# EAGLE design RescueMe (EAGLE 7.6.0)
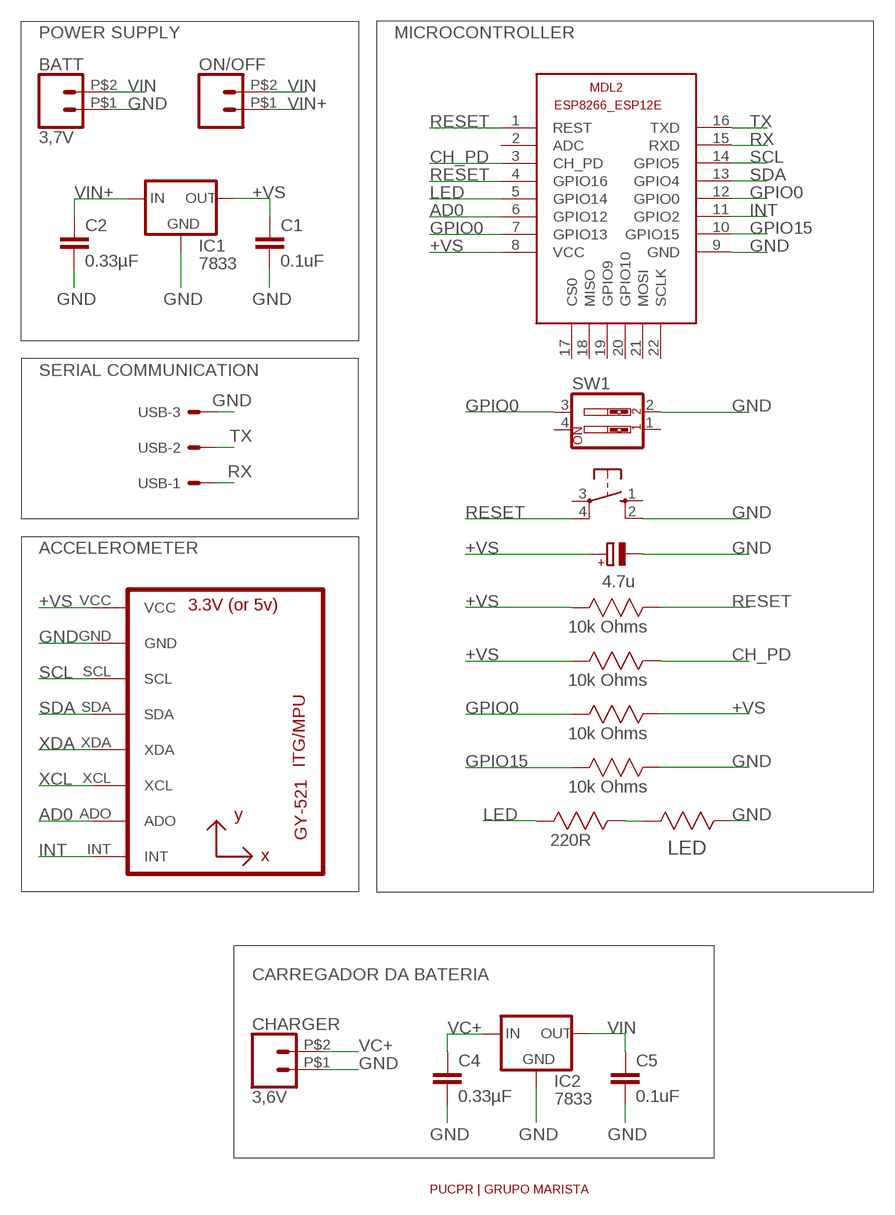
[diagram p0: schematic, sheet 1]

## Parts
BATT  3,7V  CONN_02PTH2  [1X02_BIG]
C1  0.1uF  0.33UF/330NF-0805-50V-10%  [0805]
C2  0.33µF  0.33UF/330NF-0805-50V-10%  [0805]
C4  0.33µF  0.33UF/330NF-0805-50V-10%  [0805]
C5  0.1uF  0.33UF/330NF-0805-50V-10%  [0805]
C7  4.7u  CPOL-EU153CLV-0405  [153CLV-0405]
CHARGER  3,6V  CONN_02PTH2  [1X02_BIG]
IC1  7833  78XXS  [78XXS]
IC2  7833  78XXS  [78XXS]
LED  ERA-6AEB221V  [RESC2013X65N]
MDL2  ESP8266  ESP8266-12EESP8266-ESP12E  [ESP8266-ESP12E]
ON/OFF  CONN_02PTH2  [1X02_BIG]
R_CHPD  10k Ohms  ERA6AEB103V  [RESC2013X65N]
R_G0  10k Ohms  ERA6AEB103V  [RESC2013X65N]
R_G15  10k Ohms  ERA6AEB103V  [RESC2013X65N]
R_LED  220R  ERA-6AEB221V  [RESC2013X65N]
R_RST  10k Ohms  ERA6AEB103V  [RESC2013X65N]
S1  10-XX  [B3F-10XX]
SW1  SW_DIP-2  [DIPSWITCH-02]
U1  GY-521MPU6050  [GY-521]
U$1  PUCPR_G  [PUCPR]
USB  22-27-2031-03  [6410-03]

## Nets
+VS: C1.1 C7.+ IC1.OUT MDL2.8(VCC) R_CHPD.2(R2) R_G0.1(R1) R_RST.2(R2) U1.VCC
AD0: MDL2.6(GPIO12) U1.ADO
CH_PD: MDL2.3(CH_PD) R_CHPD.1(R1)
GND: BATT.P$1 C1.2 C2.2 C4.2 C5.2 C7.- CHARGER.P$1 IC1.GND IC2.GND LED.1(R1) MDL2.9(GND) R_G15.1(R1) S1.2(S1) SW1.2 U1.GND USB.3
GPIO0: MDL2.7(GPIO13) MDL2.12(GPIO0) R_G0.2(R2) SW1.3
GPIO15: MDL2.10(GPIO15) R_G15.2(R2)
INT: MDL2.11(GPIO2) U1.INT
LED: MDL2.5(GPIO14) R_LED.2(R2)
N$1: LED.2(R2) R_LED.1(R1)
RESET: MDL2.1(REST) MDL2.4(GPIO16) R_RST.1(R1) S1.4(P1)
RX: MDL2.15(RXD) USB.1
SCL: MDL2.14(GPIO5) U1.SCL
SDA: MDL2.13(GPIO4) U1.SDA
TX: MDL2.16(TXD) USB.2
VC+: C4.1 CHARGER.P$2 IC2.IN
VIN: BATT.P$2 C5.1 IC2.OUT ON/OFF.P$2
VIN+: C2.1 IC1.IN ON/OFF.P$1
XCL: U1.XCL
XDA: U1.XDA
Unconnected: MDL2.2(ADC) MDL2.17(CS0) MDL2.18(MISO) MDL2.19(GPIO9) MDL2.20(GPIO10) MDL2.21(MOSI) MDL2.22(SCLK) S1.1(S) S1.3(P) SW1.1 SW1.4

## Notes on the sheet
- POWER SUPPLY | MICROCONTROLLER
- SERIAL COMMUNICATION
- ACCELEROMETER
- CARREGADOR DA BATERIA

## Library data of the parts
BATT CHARGER ON/OFF = SparkFun-Connectors:CONN_02: Multi connection point. Often used as Generic Header-pin footprint for 0.1 inch spaced/style header connections On any of the 0.1 inch spaced packages, you can populate with these: Break Away Headers - Straight <https://www.sparkfun.com/products/116> (PRT-00116) Break Away Male Headers - Right Angle <https://www.sparkfun.com/products/553> (PRT-00553) Female Headers <https://www.sparkfun.com/products/115> (PRT-00115) Break Away Headers - Machine Pin <https://www.sparkfun.com/products/117> (PRT-00117) Break Away Female Headers - Swiss Machine Pin <https://www.sparkfun.com/products/743> (PRT-00743) For SCREWTERMINALS and SPRING TERMINALS visit here: Screw Terimnals on SparkFun.com <https://www.sparkfun.com/search/results?term=Screw+Terminals> (5mm/3.5mm/2.54mm spacing) This device is also useful as a general connection point to wire up your design to another part of your project. Our various solder wires solder well into these plated through hole pads. Hook-Up Wire - Assortment (Stranded, 22 AWG) <https://www.sparkfun.com/products/11375> (PRT-11375) Hook-Up Wire - Assortment (Solid Core, 22 AWG) <https://www.sparkfun.com/products/11367> (PRT-11367) View the entire wire category on our website here <https://www.sparkfun.com/categories/141> Special notes: Molex polarized connector foot print use with: PRT-08233 with associated crimp pins and housings. 2.54_SCREWTERM for use with PRT-10571. 3.5mm Screw Terminal footprints for PRT-08084 5mm Screw Terminal footprints for use with PRT-08432
C1 C5 = Capacitores:0.33UF/330NF: 0.33µF/330nF ceramic capacitors A capacitor is a passive two-terminal electrical component used to store electrical energy temporarily in an electric field.; PROD_ID: CAP-08469; VALUE: 0.33µF
C2 C4 = Capacitores:0.33UF/330NF: 0.33µF/330nF ceramic capacitors A capacitor is a passive two-terminal electrical component used to store electrical energy temporarily in an electric field.; PROD_ID: CAP-08469
C7 = rcl:CPOL-EU: POLARIZED CAPACITOR, European symbol
IC1 IC2 = v-reg-3:78XXS: VOLTAGE REGULATOR
LED R_LED = Panasonic:ERA-6AEB221V: RESISTOR, 0805; MPN: ERA-6AEB221V; OC_FARNELL: 1811421; OC_NEWARK: 08N2157; SUPPLIER: Panasonic; TOLERANCE: ±0.1 %; VALUE: 220 Ohm; WATTAGE: 0.125 W
MDL2 = Espressif:ESP8266-12E: ESP8266-12E with additional I/O and GPIO04/05 corrected The author cannot warrant that this library is free from error or will meet your specific requirements. Created by PuceBaboon.com. Komagane, Nagano, JAPAN; MPN: 317060015
R_CHPD R_G0 R_G15 R_RST = Panasonic:ERA6AEB103V: RESISTOR, 0805; MPN: ERA6AEB103V; OC_FARNELL: 1577673; OC_NEWARK: 08N2142; SUPPLIER: Panasonic; TOLERANCE: ±0.1 %; WATTAGE: 0.125 W
S1 = switch-omron:10-XX: OMRON SWITCH; MPN: B3F-1000; OC_FARNELL: 176432; OC_NEWARK: 36M3542
SW1 = SparkFun:SW_DIP-2: DIP SWITCH
U1 = gy-521:GY-521
U$1 = Simbolos:PUCPR_G
USB = Molex:22-?-03: CONNECTOR wire to board 2.54 mm (.1 inch) pitch header; OC_FARNELL: unknown; OC_NEWARK: unknown

## Board
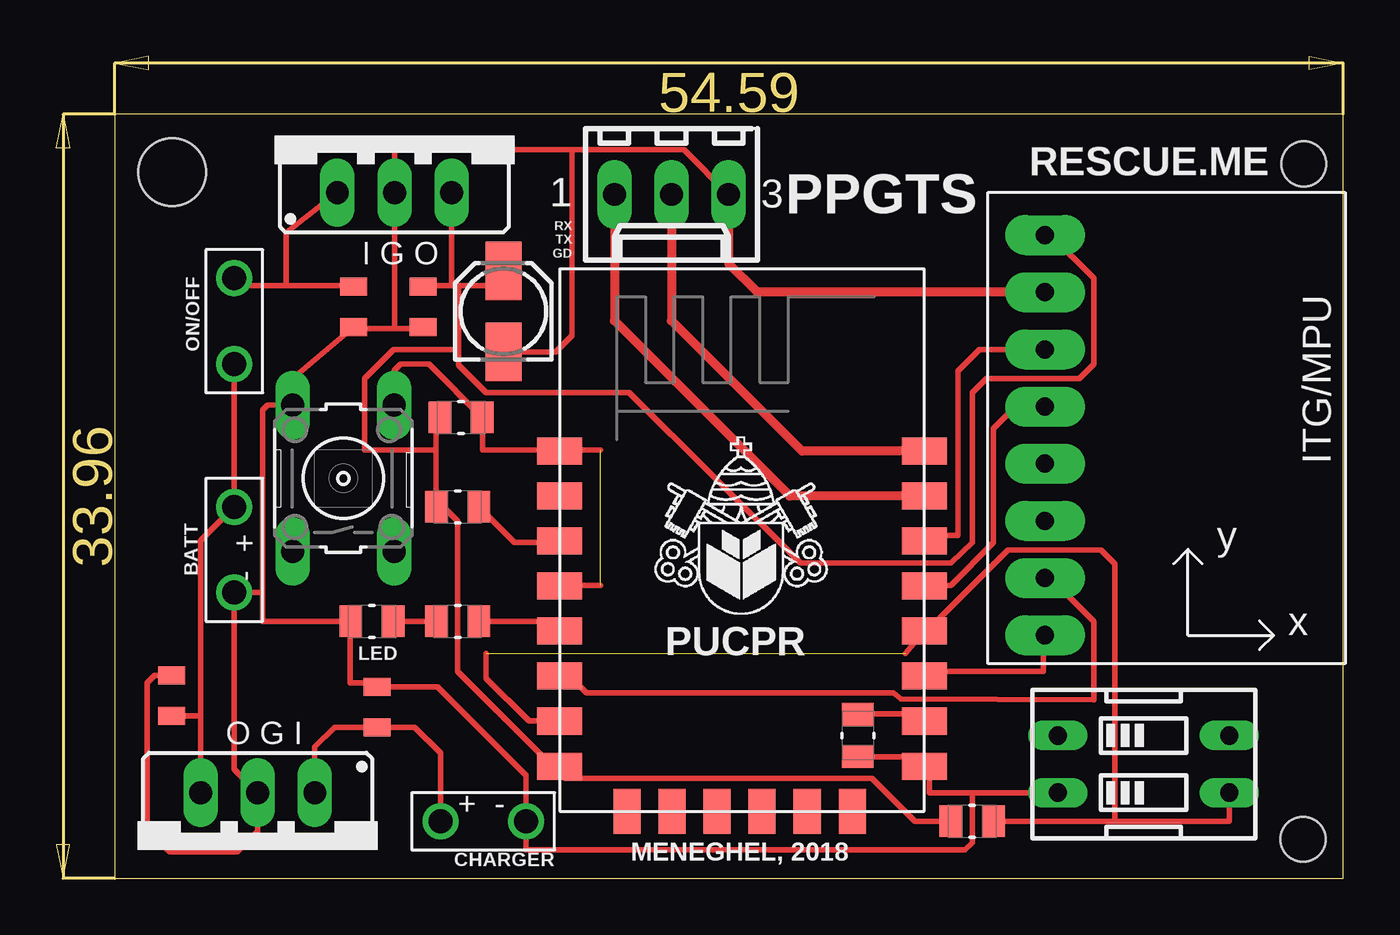
[diagram p1: board, top side]

Size 54.59 x 33.96 mm. Coordinates in mm from the lower left corner, seen from the top.
Outline: 0,0 54.59,0 54.59,33.96 0,33.96 0,0
Copper layers (1*16): Top 0.035mm / dielectric 1.5mm / Bottom 0.035mm
Design rules "default": minimum track width 10mil, minimum drill 24mil, track to track 8mil, track to pad 8mil, pad to pad 8mil, via to via 8mil, smd to smd 8mil, copper to edge 40mil, drill to drill 8mil, minimum pad ring 10mil, minimum via ring 8mil, stop-mask expansion 4mil, vias tented up to drill 0mil, thermal gap 10mil
Holes 2 mm at 52.84,31.75 52.8,1.74
Holes 3 mm at 2.55,31.39

### Footprints (pad centres in the part's own frame; a part is rotated, then mirrored left to right if it is on the bottom)
1X02_BIG = drill 1.067: P$1 0,0; P$2 3.81,0
0805 = smd 0.8 x 1.2: 1 -0.9,0; 2 0.9,0
153CLV-0405 = smd 2.6 x 1.6: + 1.8,0; - -1.8,0
78XXS = drill 1.016 long: GND 0,-2.54; IN -2.54,-2.54; OUT 2.54,-2.54
RESC2013X65N = smd 1.016 x 1.397: 1 -0.94,0; 2 0.94,0
ESP8266-ESP12E = smd 2 x 1.2: 1 -7.62,5.84; 2 -7.62,3.84; 3 -7.62,1.84; 4 -7.62,-0.16; 5 -7.62,-2.16; 6 -7.62,-4.16; 7 -7.62,-6.16; 8 -7.62,-8.16; 9 8.58,-8.16; 10 8.58,-6.16; 11 8.58,-4.16; 12 8.58,-2.16; 13 8.58,-0.16; 14 8.58,1.84; 15 8.58,3.84; 16 8.58,5.84 | smd 1.2 x 2: 17 -4.62,-10.16; 18 -2.62,-10.16; 19 -0.62,-10.16; 20 1.38,-10.16; 21 3.38,-10.16; 22 5.38,-10.16
B3F-10XX = drill 1.016 long: 1 -3.251,2.261; 2 3.251,2.261; 3 -3.251,-2.261; 4 3.251,-2.261
DIPSWITCH-02 = drill 0.813 long: 1 -1.27,-3.81; 2 1.27,-3.81; 3 1.27,3.81; 4 -1.27,3.81
GY-521 = drill 0.8 pad 1.778 long: ADO -8.89,-6.35; GND -8.89,6.35; INT -8.89,-8.89; SCL -8.89,3.81; SDA -8.89,1.27; VCC -8.89,8.89; XCL -8.89,-3.81; XDA -8.89,-1.27
6410-03 = drill 1.016 long: 1 2.54,0; 2 0,0; 3 -2.54,0

### Placement (x,y rotation side)
BATT  5.31,12.7 90 top
C1  13.7,25.4 270 top
C2  10.62,25.4 270 top
C4  11.66,7.62 90 top
C5  2.54,8.12 90 top
C7  17.27,25.2 90 top
CHARGER  18.28,2.54 180 top
IC1  12.43,33.02 0 top
IC2  6.35,1.27 180 top
LED  11.43,11.43 0 top
MDL2  27.39,13.15 0 top
ON/OFF  5.31,26.67 270 top
R_CHPD  15.24,16.51 180 top
R_G0  38.1,2.54 0 top
R_G15  33.02,6.35 90 top
R_LED  15.24,11.43 0 top
R_RST  15.39,20.49 180 top
S1  10.16,17.78 90 top
SW1  45.72,5.08 270 top
U1  50.23,19.7 0 top
U$1  27.69,14.25 0 top
USB  24.74,30.4 180 top

### Tracks (layer width: path | path; a pad name or v marks a point on that pad's centre or on a via)
+VS
  Top 0.254: 14.29,19.05 14.29,20.44 R_RST.2 | 14.29,19.05 14.29,16.51 R_CHPD.2 14.61,16.51 15.24,15.87 15.24,9.21 19.68,4.76 MDL2.8 20,4.76 20,4.45 33.66,4.45 35.56,2.54 R_G0.1 | 15.29,26.35 14.97,26.35 | IC1.OUT 14.97,26.35 | 15.29,26.35 15.29,23.5 | U1.VCC 41.59,28.57 43.5,26.67 43.5,22.86 42.86,22.23 38.73,22.23 38.1,21.59 38.1,14.92 37.15,14.02 30.48,14.02 22.86,21.59 16.51,21.59 15.29,22.81 15.29,23.5 | 14.29,19.05 11.11,19.05 11.11,22.23 12.38,23.5 15.29,23.5 | 14.97,26.35 13.75,26.35 C1.1 | 15.29,26.35 16.62,26.35 C7.+
AD0
  Top 0.254: MDL2.6 20,8.89 20.32,8.89 20.96,8.25 34.61,8.25 34.92,7.99 43.5,7.94 43.5,11.43 41.59,13.33 U1.ADO
CH_PD
  Top 0.254: MDL2.3 19.68,14.92 17.77,14.92 R_CHPD.1
GND
  Top 0.254: 12.43,24.45 10.62,24.45 C2.2 7.9,22.22 S1.2 6.79,21.03 6.58,20.82 6.58,12.7 | 12.43,24.45 13.97,24.45 C1.2 | 20.32,32.38 12.43,32.38 IC1.GND 12.43,24.45 | 20.32,32.38 25.29,32.38 USB.3 | R_G15.1 33.02,5.4 35.88,5.4 35.88,5.08 MDL2.9 36.19,4.76 36.19,3.81 38.1,3.81 | 38.1,3.81 SW1.2 | 38.1,3.81 38.1,1.59 37.78,1.27 18.28,1.27 CHARGER.P$1 18.28,4.58 14.34,8.52 C4.2 11.66,8.69 10.45,8.69 10.45,11.43 | 6.58,12.7 6.58,11.43 10.45,11.43 | 20.32,32.38 20.32,24.13 19.59,23.4 C7.- | 6.58,12.7 BATT.P$1 5.31,4.85 IC2.GND 6.35,2.09 5.45,1.19 2.45,1.19 1.45,2.19 1.45,8.69 1.78,9.02 C5.2 | 10.45,11.43 LED.1
  Top 0.406: U1.GND 28.56,26.05 27.28,27.33 USB.3
GPIO0  (1 unrouted)
  Top 0.254: 44.45,2.54 49.53,2.54 SW1.3 | 44.45,2.54 R_G0.2 | 44.45,2.54 44.45,13.97 43.81,14.6 39.69,14.6 36.19,11.11 MDL2.12 35.14,10.01 | MDL2.7 18.41,6.99 16.51,8.89 16.51,10.01
GPIO15
  Top 0.254: R_G15.2 33.02,7.3 35.88,7.3 MDL2.10
INT
  Top 0.254: MDL2.11 36.19,9.21 41.28,9.21 41.28,10.79 U1.INT
LED
  Top 0.254: R_LED.2 19.68,11.43 19.68,11.11 MDL2.5
N$1
  Top 0.254: LED.2 R_LED.1
RESET  (1 unrouted)
  Top 0.254: MDL2.4 20,13.02 21.59,13.02 | S1.4 12.42,22.58 12.7,22.86 13.96,22.86 R_RST.1 16.34,19.04 18.73,19.05 19.68,19.05 MDL2.1 20,19.05 21.59,19.05
RX
  Top 0.406: USB.1 22.2,24.79 30,16.99 MDL2.15
SCL
  Top 0.254: MDL2.14 36.19,15.24 37.47,15.24 37.47,22.54 38.42,23.5 41.28,23.5 U1.SCL
SDA
  Top 0.254: MDL2.13 36.19,13.02 37.15,13.02 39.05,14.92 39.05,20 40.02,20.97 U1.SDA
TX
  Top 0.406: MDL2.16 30.54,18.99 24.74,24.79 USB.2
VC+
  Top 0.254: CHARGER.P$2 14.47,5.58 13.33,6.72 C4.1 9.76,6.72 8.89,5.85 IC2.IN
VIN
  Top 0.254: ON/OFF.P$2 BATT.P$2 3.81,15.01 3.81,7.19 | IC2.OUT 3.81,7.19 | C5.1 3.78,7.22 3.81,7.19
VIN+
  Top 0.254: ON/OFF.P$1 5.31,26.35 7.62,26.35 | IC1.IN 7.62,28.71 7.62,26.35 | 7.62,26.35 10.57,26.35 C2.1

### Text on the board
tPlace: PPGTS | RESCUE.ME | RX / TX / GD | I G O | - + | PUCPR | O G I | + - | MENEGHEL, 2018